# Altium schematic sheet BSPD_Latching.SchDoc: BSPD: Latching
size A4; DrawnBy: Pol Feliu; DocumentNumber: 1; Revision: 1; SheetNumber: 1; SheetTotal: 4; University: UPC EEBE; City: Barcelona; Country: Spain; CP: 08019; Address: Av. Eduard Maristany, 16
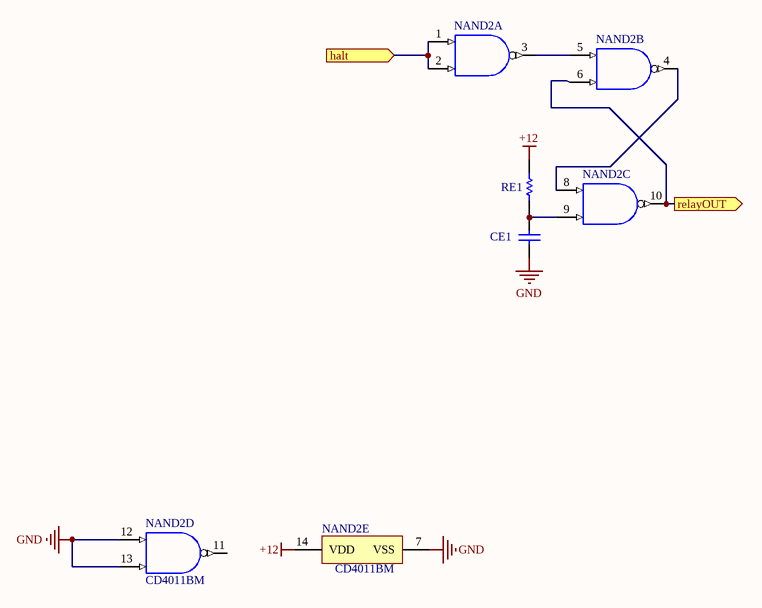
[diagram p0: BSPD_Latching.SchDoc]

## Parts
CE1  CAP 1uF  [CAPC1206(3216)190_M]  (value not drawn)
NAND2  CD4011BM  [D0014A_M]  (value not drawn)  (parts A,B,C,D,E of 5)
RE1  10K  [RESC1206(3216)_M]  (value not drawn)

## Ports
halt (in), relayOUT (out)

## Nets
+12: NAND2.14(VDD) RE1.2
GND: CE1.1 NAND2.7(VSS) NAND2.12(G) NAND2.13(H)
halt: NAND2.1(A) NAND2.2(B) ; port halt
relayOUT: NAND2.6(D) NAND2.10(L) ; port relayOUT
NetCE1_2: CE1.2 NAND2.9(F) RE1.1
NetNAND2_3: NAND2.3(J) NAND2.5(C)
NetNAND2_4: NAND2.4(K) NAND2.8(E)

Not connected (* = marked no-connect by the designer): NAND2 11(M)

## Notes on the sheet
- Title
- e-Tech Racing
- UPC EEBE
- Size:
- Date:
- Drawn by:
- A4
- Number:
- Time:
- Revision:
- Sheet
- of
- Av. Eduard Maristany, 16
- 08019
- Barcelona Spain
- Made with:
- Checked by:

## Library data of the parts
CE1 = CMP-1037-04720-1: CAP 1uF 50V ±10% 1206 (3216 Metric) Thickness 1.9mm SMD; Tolerance: Â±10%; Case-EIA: 1206; Case-Metric: 3216; Rated Voltage: 50 V; Max Thickness: 1.9 mm; Value: 1uF; Technology: SMT
NAND2 = CMP-1627-00066-2: CMOS Quad 2-Input NAND Gate, D0014A, TUBE; Manufacturer: Texas Instruments; Output Drive (IOL/IOH)(Max)(mA): 1.5/-1.5; Schmitt Trigger: No; Bits(#): 4; Voltage(Nom)(V): 10; F @ Nom Voltage(Max)(Mhz): 8; VCC(Min)(V): 3; Technology Family: CD4000; Rating: Military; VCC(Max)(V): 18; ICC @ Nom Voltage(Max)(mA): 0.015; Code_JEDEC: MS-012; DatasheetVersion: SCHS021D; Generic Part Number: CD4011B; Output Type: CMOS; PackageReference: D0014A; Input Type: CMOS; Operating Temperature Range(C): -55 to 125
RE1 = CMP-1014-00098-1: 10K 0.25W 5% 1206 (3216 Metric)  SMD; Value: 10000.00 Ohm; Case-Metric: 3216; Case-EIA: 1206; Power: 0.25 W; Tolerance: 5 %; Technology: SMT